# EAGLE design Piano2MidiSlave (EAGLE 7.6.0)

## Sheet 1 of 2
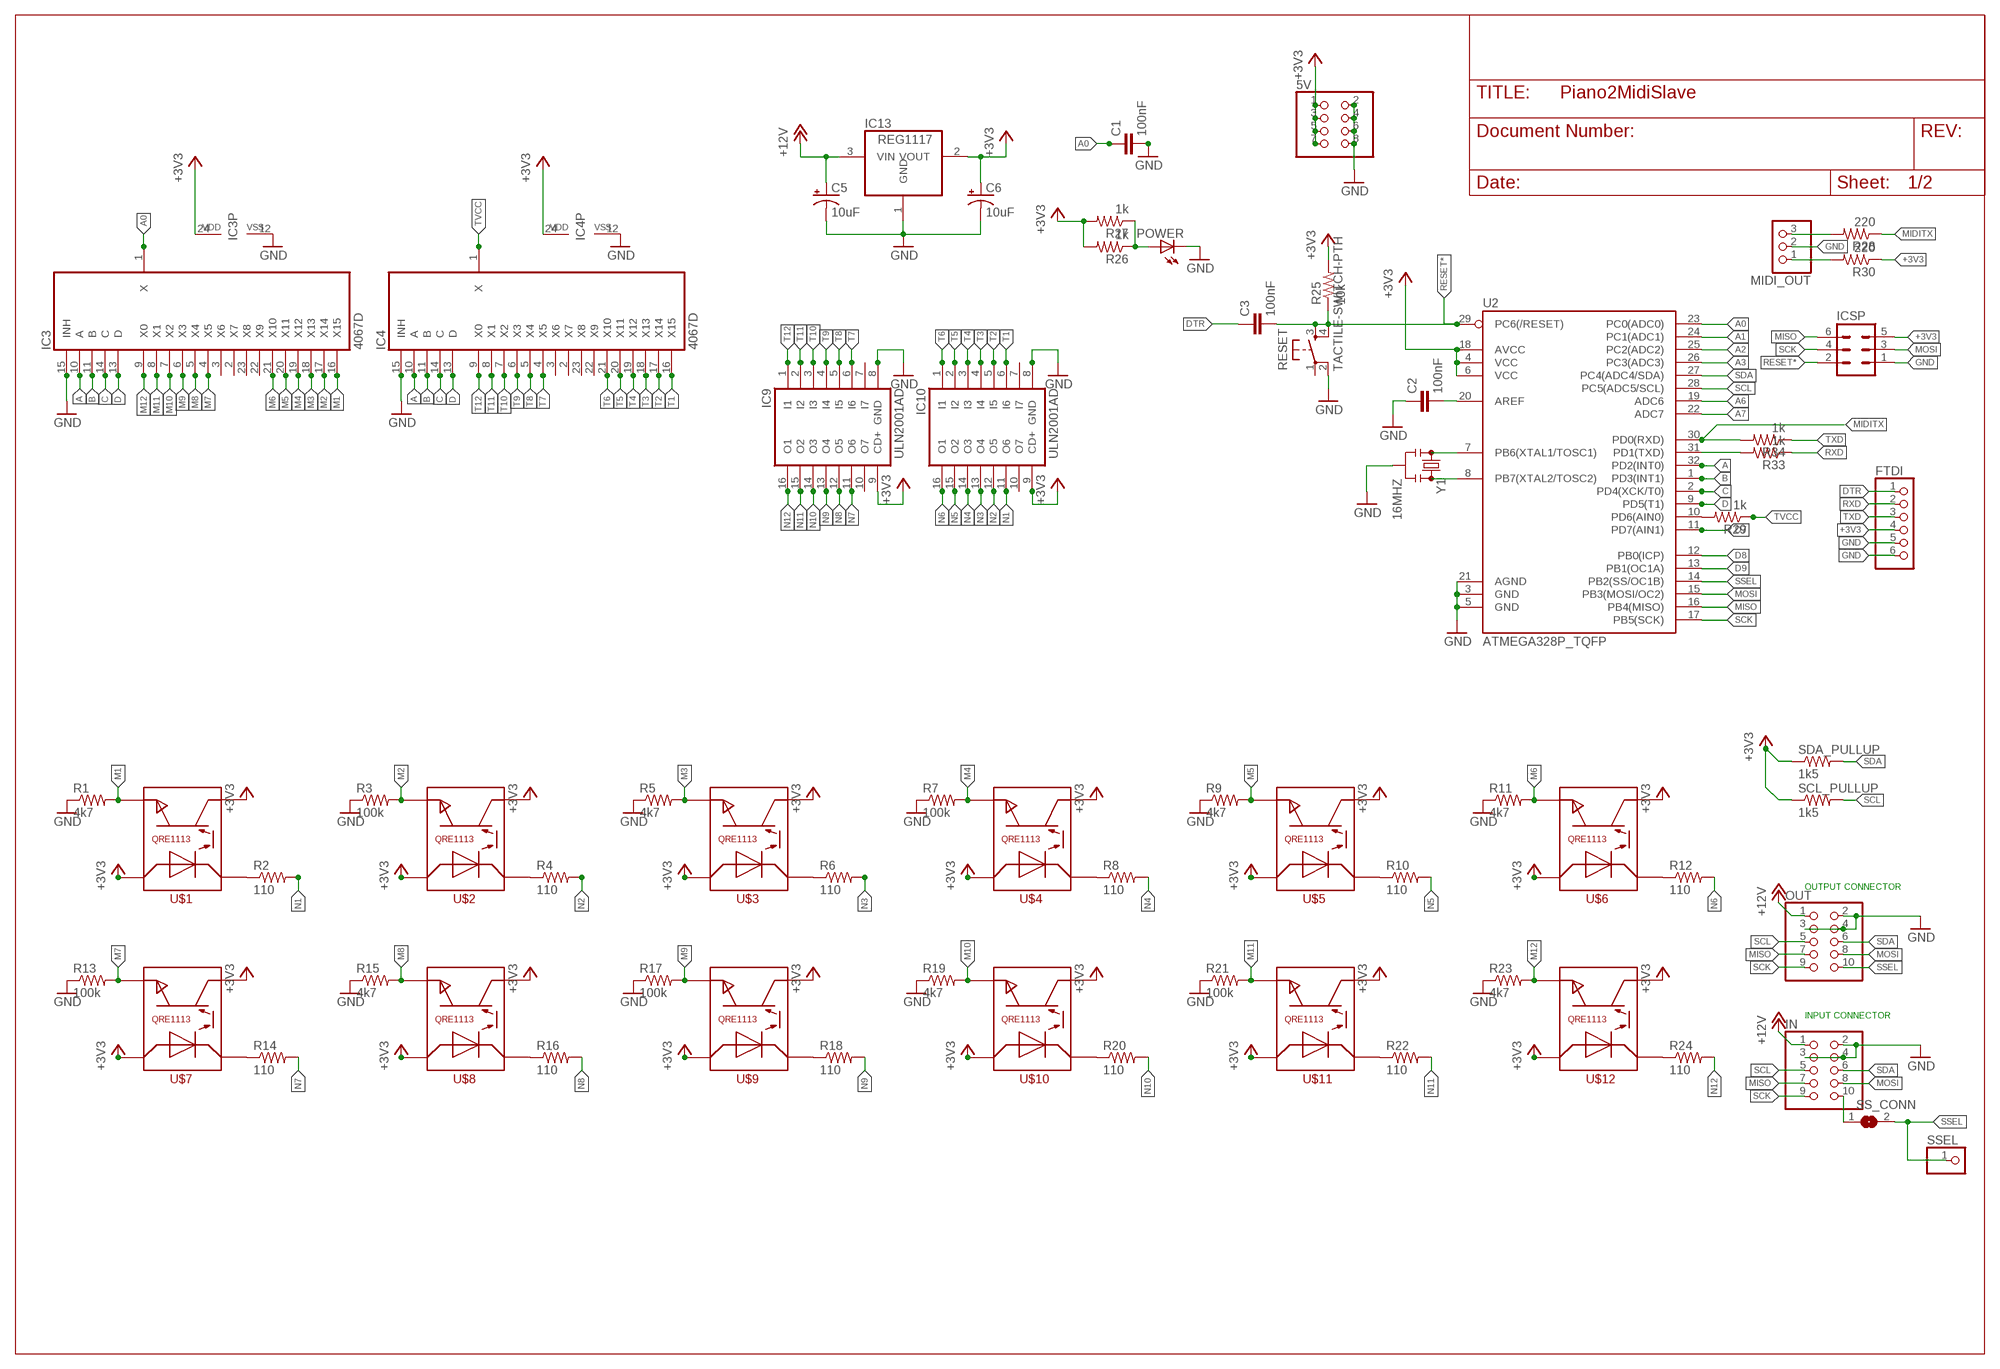
[diagram p0: schematic, sheet 1]

### Parts
5V  PINHD-2X4  [2X04]
C1  100nF  C  [C0805]
C2  100nF  C  [C0805]
C3  100nF  C  [C0805]
C5  10uF  CPOL-USSMCA  [SMC_A]
C6  10uF  CPOL-USSMCA  [SMC_A]
FTDI  PINHD-1X6  [1X06]
IC3  4067D  [SO24W]
IC4  4067D  [SO24W]
IC9  ULN2001AD  [SO16]
IC10  ULN2001AD  [SO16]
IC13  REG1117  [SOT223]
ICSP  MA03-2  [MA03-2]
IN  PINHD-2X5IDC  [2X05IDC]
MIDI_OUT  PINHD-1X3  [1X03]
OUT  PINHD-2X5IDC  [2X05IDC]
POWER  LEDCHIPLED_0805  [CHIPLED_0805]
R1  4k7  R-US_M0805  [M0805]
R2  110  R-US_M0805  [M0805]
R3  100k  R-US_M0805  [M0805]
R4  110  R-US_M0805  [M0805]
R5  4k7  R-US_M0805  [M0805]
R6  110  R-US_M0805  [M0805]
R7  100k  R-US_M0805  [M0805]
R8  110  R-US_M0805  [M0805]
R9  4k7  R-US_M0805  [M0805]
R10  110  R-US_M0805  [M0805]
R11  4k7  R-US_M0805  [M0805]
R12  110  R-US_M0805  [M0805]
R13  100k  R-US_M0805  [M0805]
R14  110  R-US_M0805  [M0805]
R15  4k7  R-US_M0805  [M0805]
R16  110  R-US_M0805  [M0805]
R17  100k  R-US_M0805  [M0805]
R18  110  R-US_M0805  [M0805]
R19  4k7  R-US_M0805  [M0805]
R20  110  R-US_M0805  [M0805]
R21  100k  R-US_M0805  [M0805]
R22  110  R-US_M0805  [M0805]
R23  4k7  R-US_M0805  [M0805]
R24  110  R-US_M0805  [M0805]
R25  10k  R-US_M0805  [M0805]
R26  1k  R-US_M0805  [M0805]
R27  1k  R-US_M0805  [M0805]
R28  220  R-US_M0805  [M0805]
R29  1k  R-US_M0805  [M0805]
R30  220  R-US_M0805  [M0805]
R33  1k  R-US_M0805  [M0805]
R34  1k  R-US_M0805  [M0805]
RESET  TACTILE-SWITCH-PTH  [TAC-SWITCH-PTH]
SCL_PULLUP  1k5  R-US_M0805  [M0805]
SDA_PULLUP  1k5  R-US_M0805  [M0805]
SS_CONN  SJ  [SJ]
SSEL  PINHD-1X1  [1X01]
U2  ATMEGA328P_TQFP  [TQFP32-08]
U$1  QRE1113QRE1113  [QRE1113]
U$2  QRE1113QRE1113  [QRE1113]
U$3  QRE1113QRE1113  [QRE1113]
U$4  QRE1113QRE1113  [QRE1113]
U$5  QRE1113QRE1113  [QRE1113]
U$6  QRE1113QRE1113  [QRE1113]
U$7  QRE1113QRE1113  [QRE1113]
U$8  QRE1113QRE1113  [QRE1113]
U$9  QRE1113QRE1113  [QRE1113]
U$10  QRE1113QRE1113  [QRE1113]
U$11  QRE1113QRE1113  [QRE1113]
U$12  QRE1113QRE1113  [QRE1113]
Y1  16MHZ  RESONATOR8MHZ  [RESONATOR-SMD]

### Nets
+3V3: 5V.1 5V.3 5V.5 5V.7 C6.+ FTDI.4(SDA) IC3.24(VDD) IC4.24(VDD) IC9.9(CD+) IC10.9(CD+) IC13.2(VOUT) ICSP.5 R25.2 R26.2 R27.2 R30.1 SCL_PULLUP.1 SDA_PULLUP.1 U2.4(VCC) U2.6(VCC) U2.18(AVCC) U$1.ANODE U$1.COLLECTOR U$2.ANODE U$2.COLLECTOR U$3.ANODE U$3.COLLECTOR U$4.ANODE U$4.COLLECTOR U$5.ANODE U$5.COLLECTOR U$6.ANODE U$6.COLLECTOR U$7.ANODE U$7.COLLECTOR U$8.ANODE U$8.COLLECTOR U$9.ANODE U$9.COLLECTOR U$10.ANODE U$10.COLLECTOR U$11.ANODE U$11.COLLECTOR U$12.ANODE U$12.COLLECTOR
+12V: C5.+ IC13.3(VIN) IN.1 OUT.1
A: IC3.10(A) IC4.10(A) U2.32(PD2(INT0))
A0: C1.1 IC3.1(X) U2.23(PC0(ADC0))
A1: U2.24(PC1(ADC1))
A2: U2.25(PC2(ADC2))
A3: U2.26(PC3(ADC3))
A6: U2.19(ADC6)
A7: U2.22(ADC7)
AREF: C2.2 U2.20(AREF)
B: IC3.11(B) IC4.11(B) U2.1(PD3(INT1))
C: IC3.14(C) IC4.14(C) U2.2(PD4(XCK/T0))
D: IC3.13(D) IC4.13(D) U2.9(PD5(T1))
D7: U2.11(PD7(AIN1))
D8: U2.12(PB0(ICP))
D9: U2.13(PB1(OC1A))
DTR: C3.1 FTDI.1(3V3)
GND: 5V.2 5V.4 5V.6 5V.8 C1.2 C2.1 C5.- C6.- FTDI.5(ADD) FTDI.6(GND) IC3.12(VSS) IC3.15(INH) IC4.12(VSS) IC4.15(INH) IC9.8(GND) IC10.8(GND) IC13.1(GND) ICSP.1 IN.2 IN.3 IN.4 MIDI_OUT.2 OUT.2 OUT.3 OUT.4 POWER.C R1.1 R3.1 R5.1 R7.1 R9.1 R11.1 R13.1 R15.1 R17.1 R19.1 R21.1 R23.1 RESET.2 U2.3(GND) U2.5(GND) U2.21(AGND) Y1.2
M1: IC3.16(X15) R1.2 U$1.EMITTER
M2: IC3.17(X14) R3.2 U$2.EMITTER
M3: IC3.18(X13) R5.2 U$3.EMITTER
M4: IC3.19(X12) R7.2 U$4.EMITTER
M5: IC3.20(X11) R9.2 U$5.EMITTER
M6: IC3.21(X10) R11.2 U$6.EMITTER
M7: IC3.4(X5) R13.2 U$7.EMITTER
M8: IC3.5(X4) R15.2 U$8.EMITTER
M9: IC3.6(X3) R17.2 U$9.EMITTER
M10: IC3.7(X2) R19.2 U$10.EMITTER
M11: IC3.8(X1) R21.2 U$11.EMITTER
M12: IC3.9(X0) R23.2 U$12.EMITTER
MIDITX: R28.1 R34.2 U2.30(PD0(RXD))
MISO: ICSP.6 IN.7 OUT.7 U2.16(PB4(MISO))
MOSI: ICSP.3 IN.8 OUT.8 U2.15(PB3(MOSI/OC2))
N1: IC10.11(O6) R2.2
N2: IC10.12(O5) R4.2
N3: IC10.13(O4) R6.2
N4: IC10.14(O3) R8.2
N5: IC10.15(O2) R10.2
N6: IC10.16(O1) R12.2
N7: IC9.11(O6) R14.2
N8: IC9.12(O5) R16.2
N9: IC9.13(O4) R18.2
N10: IC9.14(O3) R20.2
N11: IC9.15(O2) R22.2
N12: IC9.16(O1) R24.2
N$1: U2.8(PB7(XTAL2/TOSC2)) Y1.3
N$2: U2.7(PB6(XTAL1/TOSC1)) Y1.1
N$3: R4.1 U$2.CATHODE
N$4: R6.1 U$3.CATHODE
N$5: MIDI_OUT.3 R28.2
N$6: R2.1 U$1.CATHODE
N$7: POWER.A R26.1 R27.1
N$8: R8.1 U$4.CATHODE
N$9: R29.2 U2.10(PD6(AIN0))
N$10: R10.1 U$5.CATHODE
N$11: R12.1 U$6.CATHODE
N$12: R24.1 U$12.CATHODE
N$13: R33.2 U2.31(PD1(TXD))
N$14: R22.1 U$11.CATHODE
N$15: R20.1 U$10.CATHODE
N$16: R18.1 U$9.CATHODE
N$17: R16.1 U$8.CATHODE
N$18: R14.1 U$7.CATHODE
N$19: IN.10 SS_CONN.1
N$20: MIDI_OUT.1 R30.2
RESET*: C3.2 ICSP.2 R25.1 RESET.3 RESET.4 U2.29(PC6(/RESET))
RXD: FTDI.2(IRQ) R33.1
SCK: ICSP.4 IN.9 OUT.9 U2.17(PB5(SCK))
SCL: IN.5 OUT.5 SCL_PULLUP.2 U2.28(PC5(ADC5/SCL))
SDA: IN.6 OUT.6 SDA_PULLUP.2 U2.27(PC4(ADC4/SDA))
SSEL: OUT.10 SS_CONN.2 SSEL.1 U2.14(PB2(SS/OC1B))
T1: IC4.16(X15) IC10.6(I6)
T2: IC4.17(X14) IC10.5(I5)
T3: IC4.18(X13) IC10.4(I4)
T4: IC4.19(X12) IC10.3(I3)
T5: IC4.20(X11) IC10.2(I2)
T6: IC4.21(X10) IC10.1(I1)
T7: IC4.4(X5) IC9.6(I6)
T8: IC4.5(X4) IC9.5(I5)
T9: IC4.6(X3) IC9.4(I4)
T10: IC4.7(X2) IC9.3(I3)
T11: IC4.8(X1) IC9.2(I2)
T12: IC4.9(X0) IC9.1(I1)
TVCC: IC4.1(X) R29.1
TXD: FTDI.3(SCL) R34.1
Unconnected: IC3.2(X7) IC3.3(X6) IC3.22(X9) IC3.23(X8) IC4.2(X7) IC4.3(X6) IC4.22(X9) IC4.23(X8) IC9.7(I7) IC9.10(O7) IC10.7(I7) IC10.10(O7) RESET.1

### Notes on the sheet
- OUTPUT CONNECTOR
- INPUT CONNECTOR

## Sheet 2 of 2

## Library data of the parts
5V = editedadafruit:PINHD-2X4: PIN HEADER
C1-C3 = eagle-ltspice:C: CAPACITOR, European symbol; SPICEMODEL: NONE; SPICEPREFIX: C
C5 C6 = rcl:CPOL-US: POLARIZED CAPACITOR, American symbol
FTDI = adafruit:PINHD-1X6: PIN HEADER
IC3 IC4 = 40xx:4067: 16-channel ANALOG MULTIPLEXER
IC9 IC10 = uln-udn:ULN2001A: DRIVER ARRAY
IC13 = burr-brown:REG1117: 800mA and 1A Low Dropout (LDO) Positive Regulator 1.8V, 2.5V, 2.85V, 3.3V, 5V, and Adj; MPN: REG1117; OC_FARNELL: 1097566; OC_NEWARK: 14P6981
ICSP = con-lstb:MA03-2: PIN HEADER; OC_FARNELL: unknown; OC_NEWARK: unknown
IN OUT = pinhead:PINHD-2X5: PIN HEADER
MIDI_OUT = adafruit:PINHD-1X3: PIN HEADER
POWER = adafruit:LED: LED OSRAM: - CHIPLED LG R971, LG N971, LY N971, LG Q971, LY Q971, LO R971, LY R971 LH N974, LH R974 LS Q976, LO Q976, LY Q976 LO Q996 - Hyper CHIPLED LW Q18S LB Q993, LB Q99A, LB R99A - SideLED LS A670, LO A670, LY A670, LG A670, LP A670 LB A673, LV A673, LT A673, LW A673 LH A674 LY A675 LS A676, LA A676, LO A676, LY A676, LW A676 LS A679, LY A679, LG A679 - Hyper Micro SIDELED® LS Y876, LA Y876, LO Y876, LY Y876 LT Y87S - SmartLED LW L88C, LW L88S LB L89C, LB L89S, LG L890 LS L89K, LO L89K, LY L89K LS L896, LA L896, LO L896, LY L896 - TOPLED LS T670, LO T670, LY T670, LG T670, LP T670 LSG T670, LSP T670, LSY T670, LOP T670, LYG T670 LG T671, LOG T671, LSG T671 LB T673, LV T673, LT T673, LW T673 LH T674 LS T676, LA T676, LO T676, LY T676, LB T676, LH T676, LSB T676, LW T676 LB T67C, LV T67C, LT T67C, LS T67K, LO T67K, LY T67K, LW E67C LS E67B, LA E67B, LO E67B, LY E67B, LB E67C, LV E67C, LT E67C LW T67C LS T679, LY T679, LG T679 LS T770, LO T770, LY T770, LG T770, LP T770 LB T773, LV T773, LT T773, LW T773 LH T774 LS E675, LA E675, LY E675, LS T675 LS T776, LA T776, LO T776, LY T776, LB T776 LHGB T686 LT T68C, LB T68C - Hyper Mini TOPLED® LB M676 - Mini TOPLED Santana® LG M470 LS M47K, LO M47K, LY M47K Source: http://www.osram.convergy.de/
R1-R24 = adafruit:R-US_: RESISTOR, American symbol
R25-R30 R33 R34 SCL_PULLUP SDA_PULLUP = editedadafruit:R-US_: RESISTOR, American symbol
RESET = GeekAmmo:TACTILE-SWITCH: Tactile Switch 4 Pins, SPST NO
SS_CONN = jumper:SJ: SMD solder JUMPER
SSEL = adafruit:PINHD-1X1: Pin header 1x1 for 0.1" spacing With round pins
U2 = SparkFun-DigitalIC:ATMEGA328P_TQFP; PROD_ID: IC-09069
U$1-U$12 = QRE1113:QRE1113
Y1 = SparkFun-FreqCtrl:RESONATOR: Resonator Small SMD resonator. Used, eg, on the Arduino Pro/ Pro Mini boards. 8MHz- XTAL-08895 16MHz- XTAL-08900; PROD_ID: XTAL-08895; VALUE: 8MHZ

## Board
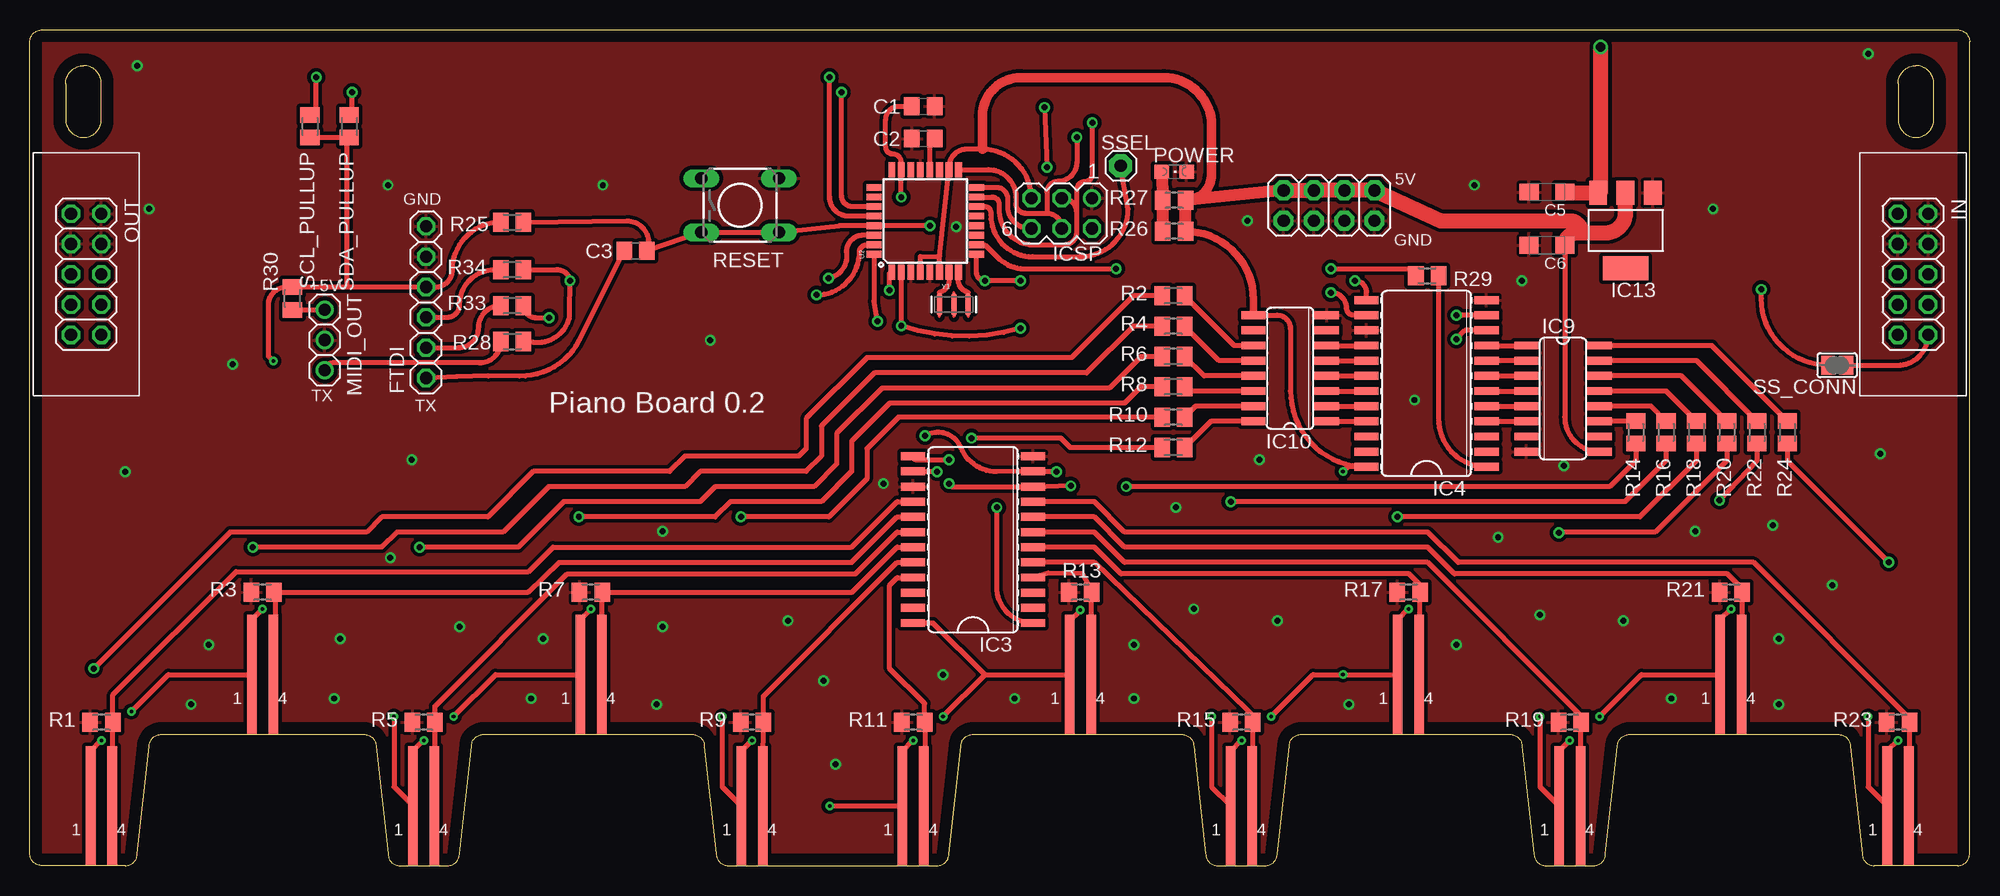
[diagram p1: board, top side]
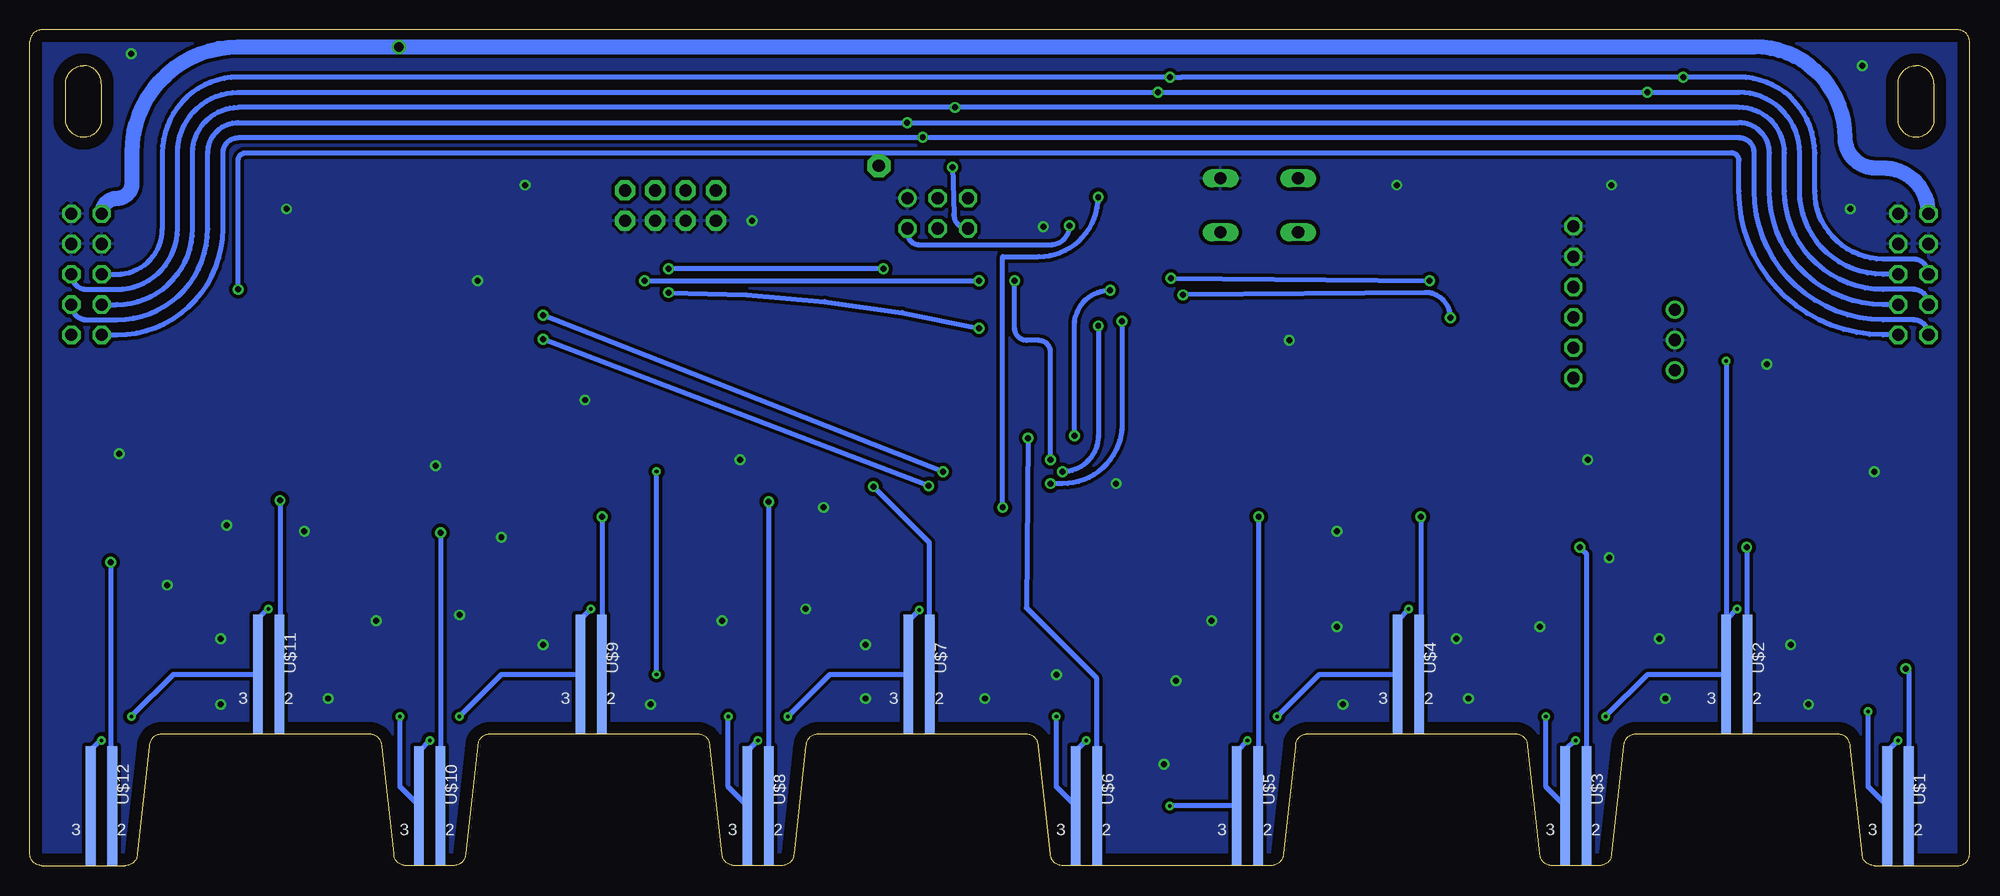
[diagram p2: board, bottom side, seen from below]

Size 162.5 x 70 mm. Coordinates in mm from the lower left corner, seen from the top.
Outline: 0,69 arc-90 1,70 161.5,70 arc-90 162.5,69 162.5,1 arc-90 161.5,0 154.5,0 arc-90 153.5,1 152.5,10 arc90 151.5,11 134,11 arc90 133,10 132,1 arc-90 131,0 127,0 arc-90 126,1 125,10 arc90 124,11 106.5,11 arc90 105.5,10 104.5,1 arc-90 103.5,0 99.5,0 arc-90 98.5,1 97.5,10 arc90 96.5,11 79,11 arc90 78,10 77,1 arc-90 76,0 58.5,0 arc-90 57.5,1 56.5,10 arc90 55.5,11 38,11 arc90 37,10 36,1 arc-90 35,0 31,0 arc-90 30,1 29,10 arc90 28,11 11,11 arc90 10,10 9,1 arc-90 8,0 1,0 arc-90 0,1 0,69
Outline: 3,65.5 3,62.5 arc90 4.5,61 arc90 6,62.5 6,65.5 arc90 4.5,67 arc90 3,65.5
Outline: 156.5,65.5 156.5,62.5 arc90 158,61 arc90 159.5,62.5 159.5,65.5 arc90 158,67 arc90 156.5,65.5
Copper layers (1*16): Top 0.035mm / dielectric 1.5mm / Bottom 0.035mm
Design rules "default": minimum track width 10mil, minimum drill 24mil, track to track 8mil, track to pad 8mil, pad to pad 8mil, via to via 8mil, smd to smd 8mil, copper to edge 40mil, drill to drill 8mil, minimum pad ring 10mil, minimum via ring 8mil, stop-mask expansion 4mil, vias tented up to drill 0mil, thermal gap 10mil

### Footprints (pad centres in the part's own frame; a part is rotated, then mirrored left to right if it is on the bottom)
2X04 = drill 1.016 pad 1.676 octagon: 1 -3.81,-1.27; 2 -3.81,1.27; 3 -1.27,-1.27; 4 -1.27,1.27; 5 1.27,-1.27; 6 1.27,1.27; 7 3.81,-1.27; 8 3.81,1.27
C0805 = smd 1.3 x 1.5: 1 -0.95,0; 2 0.95,0
SMC_A = smd 1.6 x 1.4: + -1.5,0; - 1.5,0
1X06 = drill 1.016 octagon: 1 -6.35,0; 2 -3.81,0; 3 -1.27,0; 4 1.27,0; 5 3.81,0; 6 6.35,0
SO24W = smd 0.66 x 2.032: 1 -6.985,-5.029; 2 -5.715,-5.029; 3 -4.445,-5.029; 4 -3.175,-5.029; 5 -1.905,-5.029; 6 -0.635,-5.029; 7 0.635,-5.029; 8 1.905,-5.029; 9 3.175,-5.029; 10 4.445,-5.029; 11 5.715,-5.029; 12 6.985,-5.029; 13 6.985,5.029; 14 5.715,5.029; 15 4.445,5.029; 16 3.175,5.029; 17 1.905,5.029; 18 0.635,5.029; 19 -0.635,5.029; 20 -1.905,5.029; 21 -3.175,5.029; 22 -4.445,5.029; 23 -5.715,5.029; 24 -6.985,5.029
SO16 = smd 0.66 x 2.032: 1 -4.445,-3.073; 2 -3.175,-3.073; 3 -1.905,-3.073; 4 -0.635,-3.073; 5 0.635,-3.073; 6 1.905,-3.073; 7 3.175,-3.073; 8 4.445,-3.073; 9 4.445,3.073; 10 3.175,3.073; 11 1.905,3.073; 12 0.635,3.073; 13 -0.635,3.073; 14 -1.905,3.073; 15 -3.175,3.073; 16 -4.445,3.073
SOT223 = smd 1.499 x 2.007: 1 -2.261,-3.15; 2 0.025,-3.15; 3 2.311,-3.15 | smd 3.81 x 2.007: 4 0,3.15
MA03-2 = drill 1.016: 1 -2.54,-1.27 | drill 1.016 octagon: 2 -2.54,1.27; 3 0,-1.27; 4 0,1.27; 5 2.54,-1.27; 6 2.54,1.27
2X05IDC = drill 1.016 octagon: 1 -5.08,-1.27; 2 -5.08,1.27; 3 -2.54,-1.27; 4 -2.54,1.27; 5 0,-1.27; 6 0,1.27; 7 2.54,-1.27; 8 2.54,1.27; 9 5.08,-1.27; 10 5.08,1.27
1X03 = drill 1.016: 1 -2.54,0; 2 0,0; 3 2.54,0
CHIPLED_0805 = smd 1.2 x 1.2: A 0,-1.05; C 0,1.05
M0805 = smd 1.3 x 1.6: 1 -0.95,0; 2 0.95,0
TAC-SWITCH-PTH = drill 1.016 pad 1.524 long: 1 -3.251,2.261; 2 3.251,2.261; 3 -3.251,-2.261; 4 3.251,-2.261
SJ = smd 1.168 x 1.6: 1 -0.762,0; 2 0.762,0
1X01 = drill 1.016 pad 1.93 octagon: 1 0,0
TQFP32-08 = smd 1.27 x 0.559: 1 -4.293,2.8; 2 -4.293,2; 3 -4.293,1.2; 4 -4.293,0.4; 5 -4.293,-0.4; 6 -4.293,-1.2; 7 -4.293,-2; 8 -4.293,-2.8; 17 4.293,-2.8; 18 4.293,-2; 19 4.293,-1.2; 20 4.293,-0.4; 21 4.293,0.4; 22 4.293,1.2; 23 4.293,2; 24 4.293,2.8 | smd 0.559 x 1.27: 9 -2.8,-4.293; 10 -2,-4.293; 11 -1.2,-4.293; 12 -0.4,-4.293; 13 0.4,-4.293; 14 1.2,-4.293; 15 2,-4.293; 16 2.8,-4.293; 25 2.8,4.293; 26 2,4.293; 27 1.2,4.293; 28 0.4,4.293; 29 -0.4,4.293; 30 -1.2,4.293; 31 -2,4.293; 32 -2.8,4.293
QRE1113 = smd 0.8 x 10 bottom: ANODE 0.9,5; EMITTER -0.9,5 | smd 0.8 x 10: CATHODE 0.9,5; COLLECTOR -0.9,5
RESONATOR-SMD = smd 0.45 x 1.905: 1 -1.2,0; 2 0,0; 3 1.2,0

### Placement (x,y rotation side)
5V  108.84,55.28 180 top
C1  74.84,63.6 0 top
C2  74.84,60.9 0 top
C3  50.74,51.5 0 top
C5  127.09,56.42 180 top
C6  127.08,51.96 180 top
FTDI  33.19,47.19 90 top
IC3  79.01,27.3 90 top
IC4  117,40.38 90 top
IC9  128.43,39.12 270 top
IC10  105.57,41.66 90 top
IC13  133.69,53.19 180 top
ICSP  86.44,54.63 180 top
IN  157.75,49.53 270 top
MIDI_OUT  24.7,44.02 270 top
OUT  4.71,49.53 270 top
POWER  95.86,58.12 270 top
R1  6,12 0 top
R2  95.79,47.72 0 top
R3  19.5,22.9 0 top
R4  95.79,45.18 0 top
R5  33,12 0 top
R6  95.79,42.64 0 top
R7  47,22.9 0 top
R8  95.79,40.1 0 top
R9  60.5,12 0 top
R10  95.79,37.56 0 top
R11  74,12 0 top
R12  95.79,35.02 0 top
R13  88,22.9 0 top
R14  134.53,36.29 90 top
R15  101.5,12 0 top
R16  137.06,36.29 90 top
R17  115.5,22.9 0 top
R18  139.6,36.29 90 top
R19  129,12 0 top
R20  142.15,36.29 90 top
R21  142.5,22.9 0 top
R22  144.69,36.29 90 top
R23  156.5,12 0 top
R24  147.22,36.29 90 top
R25  40.41,53.9 180 top
R26  95.86,53.12 0 top
R27  95.86,55.72 0 top
R28  40.41,43.9 180 top
R29  117.06,49.42 180 top
R30  22,47.5 270 top
R33  40.41,46.9 0 top
R34  40.41,49.9 0 top
RESET  59.5,55.3 0 top
SCL_PULLUP  23.46,61.92 90 top
SDA_PULLUP  26.76,61.92 90 top
SS_CONN  151.4,41.91 180 top
SSEL  91.38,58.62 0 top
U2  75,54 90 top
U$1  6,0 0 bottom
U$2  19.5,11 0 bottom
U$3  33,0 0 bottom
U$4  47,11 0 bottom
U$5  60.5,0 0 bottom
U$6  74,0 0 bottom
U$7  88,11 0 bottom
U$8  101.5,0 0 bottom
U$9  115.5,11 0 bottom
U$10  129,0 0 bottom
U$11  142.5,11 0 bottom
U$12  156.5,0 0 bottom
Y1  77.4,47 0 top

### Tracks (layer width: path | path; a pad name or v marks a point on that pad's centre or on a via)
+3V3  (via drill 0.3)
  Top 0.406: ICSP.5 arc90 79.8,60 78.31,60 arc90 U2.18 76.22,51.05 | R25.2 39.4,53.9 arc90 35.4,49.9 arc-90 33.96,48.46 FTDI.4 26.6,48.46 | SCL_PULLUP.1 SDA_PULLUP.1 arc90 26.6,60.81 26.6,48.46 | U2.6 76.22,51.05 | U2.4 74.6,51 76.22,51.05 | IC10.9 104.5,46.1 arc-90 105.6,45 105.6,39.77 arc90 IC4.24 110.4,33.4 v110,33 | C6.+ 128.58,37.59 arc90 IC9.9 | v8.5,12.9 11.6,16 U$2.ANODE 18.6,20.6 v19.5,21.5 | v30.5,12.5 30.5,6.6 U$3.ANODE 32.1,9.7 v33,10.5 | v35.5,12.5 39,16 U$4.ANODE 46.1,20.5 v47,21.5 | v58,12.5 58,6.6 U$5.ANODE 59.6,9.6 v60.5,10.5 | v67,5 U$6.ANODE 73.1,9.6 v74,10.5 | v76.5,12.5 80,16 | 80,16 U$7.ANODE 87.1,20.5 v88,21.4 | v99,12.5 99,6.6 U$8.ANODE 100.6,9.6 v101.5,10.5 | v104,12.5 107.5,16 v110,16 U$9.ANODE 114.6,20.6 v115.5,21.5 | 80,16 75.68,20.32 IC3.24 | v126.5,12.5 126.5,6.6 U$10.ANODE 128.1,9.6 v129,10.5 | v131.5,12.5 135,16 U$11.ANODE 141.6,20.7 v142.5,21.5 | v154,12.5 154,6.6 U$12.ANODE 155.6,9.7 v156.5,10.5 | U$1.ANODE 5.1,9.6 v6,10.5 | 26.6,48.46 26.59,48.45 R30.1 21.45,48.45 arc90 20,47 20,42.66 v20.4,42.26
  Top 0.61: R26.2 arc-90 102.5,47.43 IC10.9
  Top 0.813: R27.2 arc90 99,57.91 99,62 arc90 95,66 83,66 arc90 79.8,62.8 79.8,60
  Top 1.016: 5V.7 R27.2 R26.2
  Top 1.27: C6.+ arc-90 129.62,53 130,53 | 130,53 132,53 arc90 133.66,54.66 IC13.2 | 130,53 arc90 129,54 118.2,54 5V.1 5V.3 5V.5 5V.7
  Bottom 0.406: v20.4,42.26 U$2.COLLECTOR | v8.5,12.9 8.5,6.6 U$1.COLLECTOR 6.9,9.6 v6,10.5 | U$2.COLLECTOR 27,16 v30.5,12.5 | v35.5,12.5 35.5,6.6 U$3.COLLECTOR 33.9,9.7 v33,10.5 | v58,12.5 54.5,16 U$4.COLLECTOR 47.9,20.5 v47,21.5 | v67,5 U$5.COLLECTOR 61.4,9.6 v60.5,10.5 | v76.5,12.5 76.5,6.6 U$6.COLLECTOR 74.9,9.6 v74,10.5 | v99,12.5 95.5,16 U$7.COLLECTOR 88.9,20.5 v88,21.4 | v104,12.5 104,6.6 U$8.COLLECTOR 102.4,9.6 v101.5,10.5 | v126.5,12.5 123,16 U$9.COLLECTOR 116.4,20.6 v115.5,21.5 | v131.5,12.5 131.5,6.6 U$10.COLLECTOR 129.9,9.6 v129,10.5 | v154,12.5 150.5,16 U$11.COLLECTOR 143.4,20.7 v142.5,21.5 | v110,16 v110,33 | v19.5,21.5 20.4,20.6 U$2.COLLECTOR | v156.5,10.5 157.4,9.7 U$12.COLLECTOR
+12V  (via drill 0.8)
  Top 1.27: v131.6,68.58 131.6,56.56 arc-90 IC13.3 128.68,56.34 arc-90 C5.+
  Bottom 1.27: OUT.1 arc-90 7.26,58.42 7.89,58.42 arc90 10.43,60.96 arc-90 18.05,68.58 129,68.58 v131.6,68.58 145.05,68.58 arc-90 153.94,59.69 153.94,57.15 arc90 155.21,55.88 arc-90 IN.1
A  (via drill 0.5)
  Top 0.406: U2.32 70.71,47.29 v71,45.6 | v77,32 arc90 77.25,31.75 IC3.10 arc90 84.09,31.7 v87.2,31.8 | IC4.10 120.23,44.83 v119.5,44.1
  Bottom 0.406: v71,45.6 71,37 arc90 76,32 v77,32 | v87.2,31.8 v119.5,44.1
A0  (via drill 0.5)
  Top 0.406: C1.1 72.8,63.6 arc90 71.7,62.5 71.7,60.2 arc90 72.3,59.6 arc-90 72.99,58.91 72.99,58.3 arc90 U2.23 v73,56 | IC3.1 arc-90 81,23.36 v81,30
  Bottom 0.406: v81,30 81,51 78,51 arc-90 v73,56
AREF
  Top 0.406: U2.20 75.4,60.29 arc90 C2.2
B  (via drill 0.5)
  Top 0.406: v75,36 arc-99 78,35 arc68 81,33 IC3.11 arc90 84.06,33 v86,33 | v72,48.2 72,49.51 arc-90 U2.1 | IC4.11 120,46.1 v119.5,46.1
  Bottom 0.406: v75,36 75,45.2 arc90 v72,48.2 | v86,33 v119.5,46.1
C  (via drill 0.5)
  Top 0.406: U2.2 v73,45.2 arc34 v83,45 | v76,33 74,33 arc-90 IC3.14 | IC4.14 110.9,46.1 arc-90 110.3,46.7 arc90 v109,48
  Bottom 0.406: v73,45.2 73,36 arc90 v76,33 | v109,48 arc13 v83,45
D  (via drill 0.5)
  Top 0.406: IC3.13 arc90 74.27,34 v77,34 | U2.9 79.29,49.71 arc90 v80,49 v83,49 | IC4.13 111.97,48.03 arc90 v111,49
  Bottom 0.406: v77,34 77,43 arc-90 78,44 79,44 arc90 80,45 v80,49 | v111,49 v83,49
DTR
  Top 0.406: C3.1 46,44 arc-64 41,41 arc5 FTDI.1
GND  (via drill 0.5)
  other vias: 8,33 26,19 36,20 43,19 53,20 13.5,13.5 15,18.5 25.5,14 30.2,25.8 42,14 53,28 52.5,13.5 63.5,20.5 66.5,15.5 67.5,8.5 76.5,16 82.5,14 92.5,14 92.5,18.5 97.5,21.5 104.5,20.5 96,30 123,27.5 126.5,21 119.5,18.5 110.5,13.5 133.5,20.5 139.5,28 146,28.5 137.5,14 146.5,13.5 146.5,19 151,23.5 155,34.5 57,44 48,57 32,34 30,57 17,42 10,55 9,67 154,68 125,49 121,57 116,39 103,34 128.5,33.5 71.5,32 102,54 141,55 77.6,53.5
  pour Bottom (isolate 0.305): 0,-3 0,70 162.5,70 162.5,0 3,0
  pour Top (isolate 0.305): 0,70 162.5,70 162.5,0 0,0
M1
  Top 0.406: U$1.EMITTER R1.2 6.95,14.3 17.28,24.63 41.78,24.63 43.82,26.67 68.85,26.67 72.66,30.48 IC3.16
M2
  Top 0.406: U$2.EMITTER 20.59,22.86 R3.2 41.72,22.9 44.32,25.4 68.85,25.4 72.66,29.21 IC3.17
M3
  Top 0.406: U$3.EMITTER R5.2 33.95,13.36 45.02,24.43 69.15,24.43 72.66,27.94 IC3.18
M4
  Top 0.406: IC3.19 72.66,26.67 68.89,22.9 R7.2 U$4.EMITTER
M5
  Top 0.406: IC3.20 72.66,25.4 61.45,14.19 R9.2 U$5.EMITTER
M6
  Top 0.406: IC3.21 72.66,24.13 72.03,23.5 72.03,16.51 74.95,13.59 R11.2 75,11 U$6.EMITTER
M7
  Top 0.406: R13.2 88.95,23 | 88.95,23 88.95,23.08 88.2,24.43 85.3,24.5 IC3.4 | U$7.EMITTER 88.95,23
M8
  Top 0.406: IC3.5 89.17,25.4 102,13 102.45,12.55 R15.2 U$8.EMITTER
M9
  Top 0.406: IC3.6 89.17,26.67 91.41,24.43 115.54,24.43 116.45,23.52 R17.2 U$9.EMITTER
M10
  Top 0.406: IC3.7 89.17,27.94 91.71,25.4 117.11,25.4 129.95,12.56 R19.2 U$10.EMITTER
M11
  Top 0.406: IC3.8 89.17,29.21 91.71,26.67 117.11,26.67 119.35,24.43 142.21,24.43 143.45,23.19 R21.2 U$11.EMITTER
M12
  Top 0.406: IC3.9 89.17,30.48 91.71,27.94 117.11,27.94 119.65,25.4 144.41,25.4 157.45,12.37 R23.2 U$12.EMITTER
MIDITX  (via drill 0.5)
  Top 0.406: R28.1 41.9,43.9 arc90 45.2,45.9 45.2,46.36 v45.24,49 arc90 44.04,49.9 R34.2 | U2.30 69.8,52.8 arc90 68.4,51.4 arc-90 v66.9,49.2
  Bottom 0.406: v66.9,49.2 v45.24,49
MISO  (via drill 0.5)
  Top 0.406: U2.16 80.8,56.8 arc-90 81.9,56 81.9,55.16 arc90 ICSP.6 | v85,63.5 v85.2,58.5
  Bottom 0.406: OUT.7 arc-90 4.71,48.26 7.26,48.26 arc90 15.51,56.52 15.51,59.69 arc-90 19.32,63.5 v85,63.5 145.05,63.5 arc-90 148.86,59.69 148.86,53.34 arc90 155.21,46.99 IN.7 | v85.2,58.5 85.1,54.56 arc-90 ICSP.6
MOSI  (via drill 0.5)
  Top 0.406: U2.15 80.6,56 arc-90 81.2,55.4 81.2,55 arc90 84,52 86.6,52 arc90 87.7,53 87.7,54.74 | 87.7,54.74 arc90 ICSP.3 | 87.7,54.74 87.7,56.6 arc-90 88.4,57.3 arc90 89,57.9 v89,62.23
  Bottom 0.406: OUT.8 7.26,46.99 arc90 16.78,56.52 16.78,59.69 arc-90 19.32,62.23 v89,62.23 145.05,62.23 arc-90 147.59,59.69 147.59,53.34 arc90 155.21,45.72 157.75,45.72 arc90 IN.8
N1
  Top 0.406: IC10.11 100.9,43.56 R2.2
N2
  Top 0.406: IC10.12 99.63,42.29 R4.2
N3
  Top 0.406: IC10.13 98.36,41.02 R6.2
N4
  Top 0.406: IC10.14 97.09,39.75 R8.2
N5
  Top 0.406: IC10.15 97.66,38.48 R10.2
N6
  Top 0.406: IC10.16 98.93,37.21 R12.2
N7
  Top 0.406: R14.2 134.5,37.21 IC9.11
N8
  Top 0.406: R16.2 135.82,38.48 IC9.12
N9
  Top 0.406: R18.2 137.09,39.75 IC9.13
N10
  Top 0.406: R20.2 138.37,41.02 IC9.14
N11
  Top 0.406: R22.2 139.63,42.29 IC9.15
N12
  Top 0.406: R24.2 140.91,43.56 IC9.16
N$1
  Top 0.406: 78.6,48.02 arc-90 77.8,49.42 U2.8
N$2
  Top 0.406: 76.2,48.02 arc90 77,49.42 U2.7
N$3  (via drill 0.5)
  Top 0.406: R4.1 92.44,45.18 88.53,41.27 70.75,41.27 66.31,36.83 66.31,34.29 65.04,33.02 56.15,33.02 54.88,31.75 43.45,31.75 39.64,27.94 30.75,27.94 29.48,26.67 v18.68,26.67
  Bottom 0.406: v18.68,26.67 18.68,16.09 U$2.CATHODE
N$4  (via drill 0.5)
  Top 0.406: R6.1 93.08,42.64 90.44,40.01 71.39,40.01 67.58,36.2 67.58,33.66 65.67,31.75 57.42,31.75 56.15,30.48 44.72,30.48 40.91,26.67 v32.66,26.67
  Bottom 0.406: v32.66,26.67 32.1,26.11 U$3.CATHODE
N$5
  Top 0.406: R28.2 arc-90 37.66,42.1 25.32,42.1 arc90 MIDI_OUT.3
N$6  (via drill 0.5)
  Top 0.406: R2.1 92.44,47.72 87.27,42.55 70.12,42.55 65.04,37.47 65.04,34.92 64.41,34.29 54.88,34.29 53.61,33.02 42.18,33.02 38.37,29.21 29.48,29.21 28.21,27.94 16.78,27.94 v5.35,16.51
  Bottom 0.406: v5.35,16.51 5.1,16.26 U$1.CATHODE
N$7
  Top 1.016: POWER.A R27.1 R26.1
N$8  (via drill 0.5)
  Top 0.406: R8.1 93.08,40.1 91.71,38.73 72.03,38.73 68.85,35.56 68.85,33.02 66.31,30.48 58.69,30.48 57.42,29.21 v45.99,29.21
  Bottom 0.406: v45.99,29.21 45.99,16.11 U$4.CATHODE
N$9  (via drill 0.5)
  Top 0.406: U2.10 80,52 81,51 arc37 83,50 v91,50 | v109,50 115.53,50 arc-90 R29.2
  Bottom 0.406: v91,50 v109,50
N$10  (via drill 0.5)
  Top 0.406: R10.1 72.75,37.56 70.12,34.92 70.12,32.38 66.94,29.21 v59.56,29.21
  Bottom 0.406: v59.56,29.21 59.56,5.36 U$5.CATHODE
N$11  (via drill 0.5)
  Top 0.406: R12.1 87.17,35.02 86.38,35.81 v78.88,35.81
  Bottom 0.406: v78.88,35.81 79.01,21.59 73.17,15.75 73.17,5.07 U$6.CATHODE
N$12  (via drill 0.5)
  Top 0.406: R24.1 147.22,33.89 v155.72,25.4
  Bottom 0.406: v155.72,25.4 155.72,5.12 U$12.CATHODE
N$13  (via drill 0.5)
  Top 0.406: R33.2 arc90 42.36,45.9 v43.5,45.9 | v65.9,47.8 arc90 69.5,51.4 arc-90 70.1,52 U2.31
  Bottom 0.406: v43.5,45.9 arc-90 45.6,48 v65.9,47.8
N$14  (via drill 0.5)
  Top 0.406: R22.1 144.69,33.92 v141.55,30.59
  Bottom 0.406: v141.55,30.59 141.55,15.85 U$11.CATHODE
N$15  (via drill 0.5)
  Top 0.406: R20.1 142.15,33.92 136.16,27.94 128.54,27.94 v128.09,27.89
  Bottom 0.406: v128.09,27.89 128.09,5.19 U$10.CATHODE
N$16  (via drill 0.5)
  Top 0.406: R18.1 139.6,33.92 134.89,29.21 v114.57,29.21
  Bottom 0.406: v114.57,29.21 114.57,16.03 U$9.CATHODE
N$17  (via drill 0.5)
  Top 0.406: R16.1 137.06,33.92 133.62,30.48 v100.6,30.48
  Bottom 0.406: v100.6,30.48 U$8.CATHODE
N$18  (via drill 0.5)
  Top 0.406: R14.1 134.53,33.92 132.35,31.75 v91.84,31.75
  Bottom 0.406: U$7.CATHODE 87.14,16.04 87.14,27.05 v91.84,31.75
N$19
  Top 0.406: SS_CONN.1 156.48,41.91 arc90 IN.10
N$20
  Top 0.406: R30.2 MIDI_OUT.1
RESET*  (via drill 0.5)
  Top 0.406: v75.4,53.6 U2.29 67.81,53.6 RESET.4 arc1 RESET.3 C3.2 arc113 50,54 R25.1
  Bottom 0.406: ICSP.2 88.98,52.98 arc-90 88,52 77,52 arc-90 v75.4,53.6
RXD
  Top 0.406: FTDI.2 35.88,43.38 arc90 37.6,45.1 arc-90 39.4,46.9 R33.1
SCK  (via drill 0.5)
  Top 0.406: U2.17 80.31,58.29 arc-90 82.6,56 82.6,55.4 arc90 83.4,54.65 85.2,54.65 | 85.2,54.65 arc-90 ICSP.4 | v87.7,61 87.7,58.9 arc-90 86.1,57.3 arc90 85.2,56.4 85.2,54.65
  Bottom 0.406: OUT.9 arc-90 4.71,45.72 7.26,45.72 arc90 18.05,56.52 18.05,59.69 arc-90 19.32,60.96 87.66,60.96 | 87.66,60.96 145.05,60.96 arc-90 146.32,59.69 146.32,53.34 arc90 155.21,44.45 IN.9 | 87.66,60.96 arc90 v87.7,61
SCL  (via drill 0.5)
  Top 0.406: SCL_PULLUP.2 arc90 24,63.41 v24,66.04 | U2.28 68.6,54.4 arc-90 67,56 v67,66.04
  Bottom 0.406: OUT.5 arc-90 4.71,50.8 7.26,50.8 arc90 12.97,56.52 12.97,59.69 arc-90 19.32,66.04 v24,66.04 66,66.04 v67,66.04 145.05,66.04 arc-90 151.4,59.69 151.4,53.34 arc90 155.21,49.53 IN.5
SDA  (via drill 0.5)
  Top 0.406: SDA_PULLUP.2 arc90 27,63.11 v27,64.77 | U2.27 68.9,55.2 arc-90 68,56.1 v68,64.77
  Bottom 0.406: OUT.6 7.26,49.53 arc90 14.24,56.52 14.24,59.69 arc-90 19.32,64.77 v27,64.77 67,64.77 v68,64.77 145.05,64.77 arc-90 150.13,59.69 150.13,53.34 arc90 155.21,48.26 157.75,48.26 arc90 IN.6
SSEL  (via drill 0.5)
  Top 0.406: SS_CONN.2 arc-90 145.05,47.5 v145.05,48.26 | U2.14 80,55.2 arc-90 80.5,54.7 80.5,54.5 arc90 84,51 88,51 arc90 92,55 SSEL.1
  Bottom 0.406: OUT.10 7.26,44.45 arc90 19.32,56.52 19.32,59.05 arc-90 19.95,59.69 91,59.69 | v145.05,48.26 145.05,59.05 arc90 144.41,59.69 91,59.69 | SSEL.1 91,59.69
T1
  Top 0.406: IC10.6 IC4.16
T2
  Top 0.406: IC10.5 IC4.17
T3
  Top 0.406: IC10.4 IC4.18
T4
  Top 0.406: IC10.3 IC4.19
T5
  Top 0.406: IC10.2 IC4.20
T6
  Top 0.406: IC10.1 IC4.21
T7
  Top 0.406: IC4.4 IC9.6
T8
  Top 0.406: IC4.5 IC9.5
T9
  Top 0.406: IC4.6 IC9.4
T10
  Top 0.406: IC4.7 IC9.3
T11
  Top 0.406: IC9.2 IC4.8
T12
  Top 0.406: IC4.9 IC9.1
TVCC
  Top 0.406: R29.1 118.01,37.42 arc90 IC4.1
TXD
  Top 0.406: FTDI.3 34.92,45.92 arc90 36,47 arc-90 38.9,49.9 R34.1

### Text on the board
tPlace: GND | +5V | TX | TX | Piano Board 0.2
tNames: 5V | GND